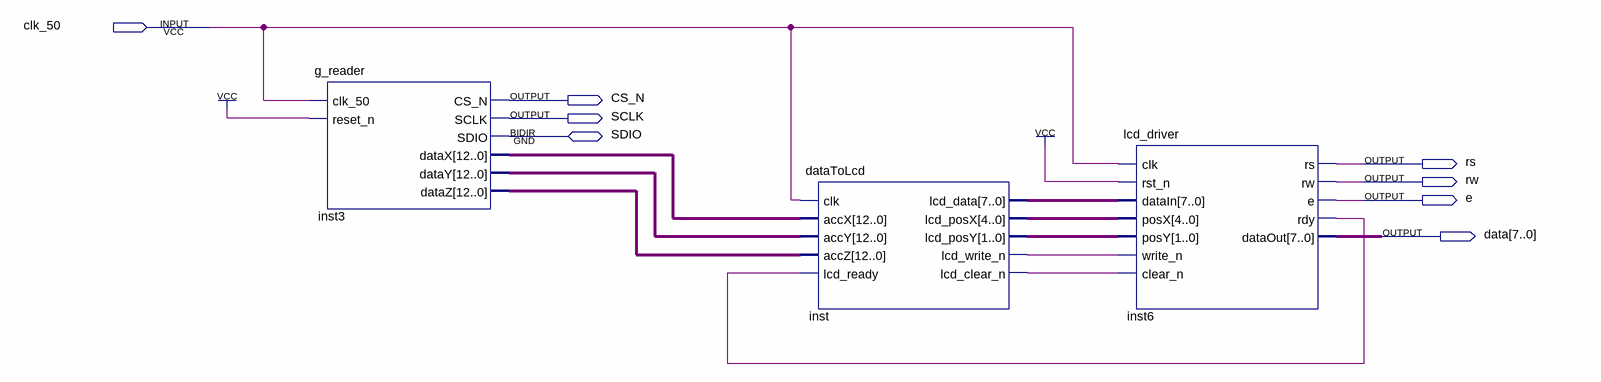
[diagram p0: schematic sheet]
// Quartus schematic gSensorToLCD.bdf as structural Verilog: 3 symbols, 8 pins
module gSensorToLCD (
  input  clk_50,
  inout  SDIO,
  output CS_N,
  output SCLK,
  output rs,
  output rw,
  output e,
  output [7:0] data
);

  wire inst6_rdy, inst_lcd_clear_n, inst_lcd_write_n;
  wire [1:0] inst_lcd_posy;
  wire [4:0] inst_lcd_posx;
  wire [7:0] inst_lcd_data;
  wire [12:0] inst3_datax, inst3_datay, inst3_dataz;

  g_reader inst3 (
    .clk_50(clk_50), .reset_n(1'b1), .CS_N(CS_N), .SCLK(SCLK), .dataX(inst3_datax), .dataY(inst3_datay),
    .dataZ(inst3_dataz), .SDIO(SDIO));
  dataToLcd inst (
    .clk(clk_50), .accX(inst3_datax), .accY(inst3_datay), .accZ(inst3_dataz), .lcd_ready(inst6_rdy),
    .lcd_data(inst_lcd_data), .lcd_posX(inst_lcd_posx), .lcd_posY(inst_lcd_posy),
    .lcd_write_n(inst_lcd_write_n), .lcd_clear_n(inst_lcd_clear_n));
  lcd_driver inst6 (
    .clk(clk_50), .rst_n(1'b1), .dataIn(inst_lcd_data), .posX(inst_lcd_posx), .posY(inst_lcd_posy),
    .write_n(inst_lcd_write_n), .clear_n(inst_lcd_clear_n), .rs(rs), .rw(rw), .e(e), .rdy(inst6_rdy),
    .dataOut(data));
endmodule
